# EAGLE schematic attiny_45_noise_ldr (EAGLE 6.4)
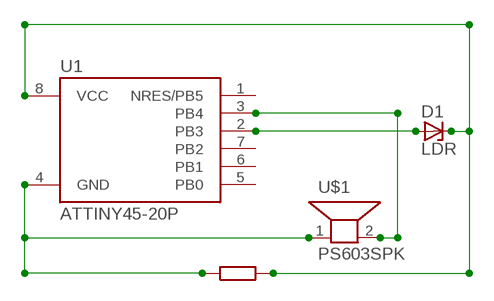
[diagram p0: schematic, sheet 1]

## Parts
D1  LDR  1N821  [DO35Z10]
U1  ATTINY45-20P  [PDIP08_300MIL]
U$1  PS603SPK  [PS603]

## Nets
N$1: D1.A U1.2(PB3)
N$2: D1.C U1.8(VCC)
N$3: U1.4(GND) U$1.1
N$5: U1.3(PB4) U$1.2
Unconnected: U1.1(NRES/PB5) U1.5(PB0) U1.6(PB1) U1.7(PB2)

## Library data of the parts
D1 = diode:1N821: Reference DIODE temperature compensated, 6,2 V
U1 = _hhn_attiny25_45_85:ATTINY45*: ATMEL ATtiny 45 Packages: P = PDIP 08 30mil S = SOIC 08 EIAJ 208mil X = TSSOP 08 4.4mm Technologies Note: for complete ordering code (temp. range, finish, tape&reel etc.) see www.atmel.com • Supply Voltage: V = (1.8…5.5)V | [blank] = (2.7…5.5)V • Speed: 10 = 10 MHz | 20 = 20 MHz Author: Dipl.-Ing. FH Rainer Bayer HHN Hochschule Heilbronn (Heilbronn University), rainer.bayer@hs-heilbronn.de Ingenieurbüro ing-rb, mail@ing-rb.de
U$1 = adafruit:PS603: PS603 Small 8 ohm speaker, from Mouser. Can SMT solder to board http://www.ladyada.net/library/pcb/eaglelibrary.html